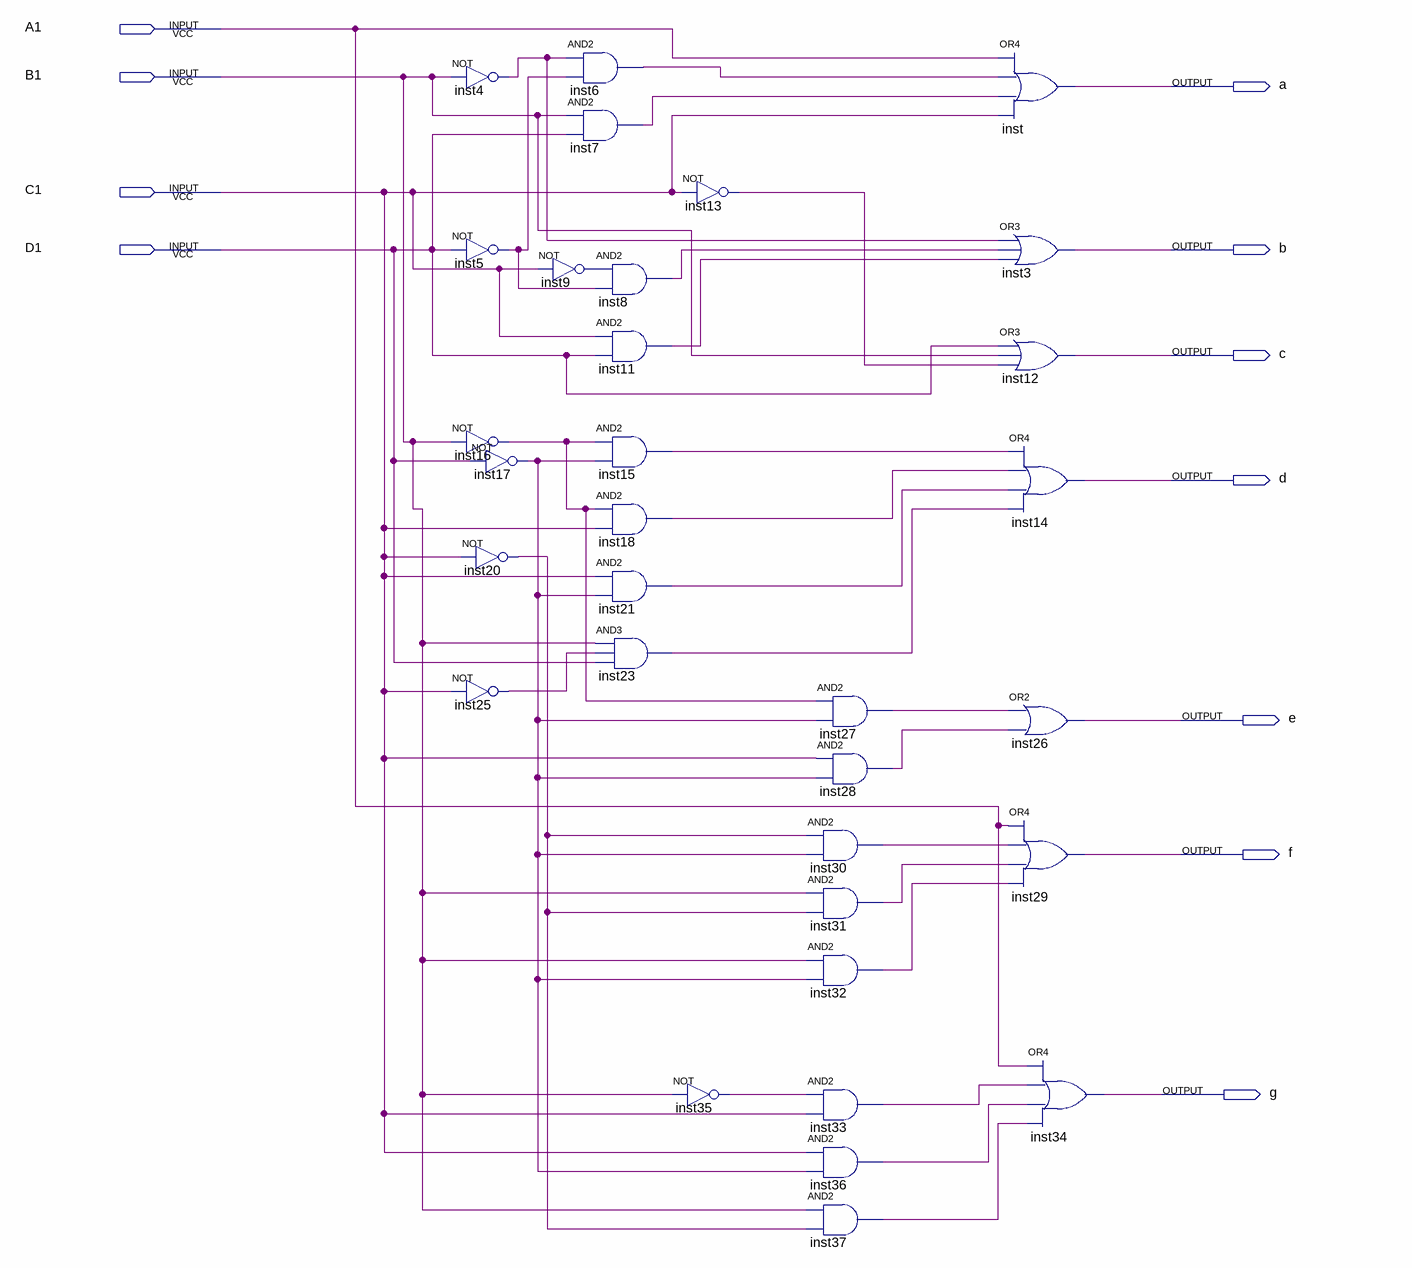
[diagram p0: schematic sheet]
// Quartus schematic decodBlock.bdf as structural Verilog: 32 symbols, 11 pins
module decodBlock (
  input  A1,
  input  B1,
  input  C1,
  input  D1,
  output a,
  output b,
  output c,
  output d,
  output e,
  output f,
  output g
);

  wire inst4_out, inst5_out, inst6_out, inst7_out, inst8_out, inst9_out, inst11_out, inst13_out, inst15_out,
       inst16_out, inst17_out, inst18_out, inst20_out, inst21_out, inst23_out, inst25_out, inst27_out,
       inst28_out, inst30_out, inst31_out, inst32_out, inst33_out, inst35_out, inst36_out, inst37_out;

  not inst4 (inst4_out, B1);
  not inst5 (inst5_out, D1);
  not inst16 (inst16_out, B1);
  not inst17 (inst17_out, D1);
  not inst20 (inst20_out, C1);
  not inst25 (inst25_out, C1);
  and inst6 (inst6_out, inst4_out, inst5_out);
  and inst7 (inst7_out, B1, D1);
  and inst8 (inst8_out, inst9_out, inst5_out);
  not inst9 (inst9_out, C1);
  and inst11 (inst11_out, C1, D1);
  and inst15 (inst15_out, inst16_out, inst17_out);
  and inst18 (inst18_out, inst16_out, C1);
  and inst21 (inst21_out, C1, inst17_out);
  and inst23 (inst23_out, B1, inst25_out, D1);
  not inst35 (inst35_out, B1);
  not inst13 (inst13_out, C1);
  and inst27 (inst27_out, inst16_out, inst17_out);
  and inst28 (inst28_out, C1, inst17_out);
  and inst30 (inst30_out, inst20_out, inst17_out);
  and inst31 (inst31_out, B1, inst20_out);
  and inst32 (inst32_out, B1, inst17_out);
  and inst33 (inst33_out, inst35_out, C1);
  and inst36 (inst36_out, C1, inst17_out);
  and inst37 (inst37_out, B1, inst20_out);
  or inst (a, A1, inst6_out, inst7_out, C1);
  or inst3 (b, inst4_out, inst8_out, inst11_out);
  or inst12 (c, D1, B1, inst13_out);
  or inst14 (d, inst15_out, inst18_out, inst21_out, inst23_out);
  or inst26 (e, inst27_out, inst28_out);
  or inst29 (f, A1, inst30_out, inst31_out, inst32_out);
  or inst34 (g, A1, inst33_out, inst36_out, inst37_out);
endmodule
